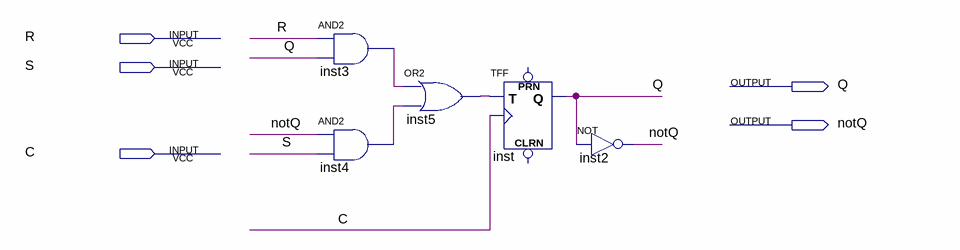
[diagram p0: schematic sheet]
// Quartus schematic RSFF.bdf as structural Verilog: 5 symbols, 5 pins
module RSFF (
  input  R,
  input  S,
  input  C,
  output Q,
  output notQ
);

  wire inst3_out, inst4_out, inst5_out;

  and inst3 (inst3_out, R, Q);
  and inst4 (inst4_out, notQ, S);
  or inst5 (inst5_out, inst3_out, inst4_out);
  TFF inst (.T(inst5_out), .CLK(C), .Q(Q));  // open: PRN, CLRN
  not inst2 (notQ, Q);
endmodule
